# EAGLE design ardustation (EAGLE 5.11)
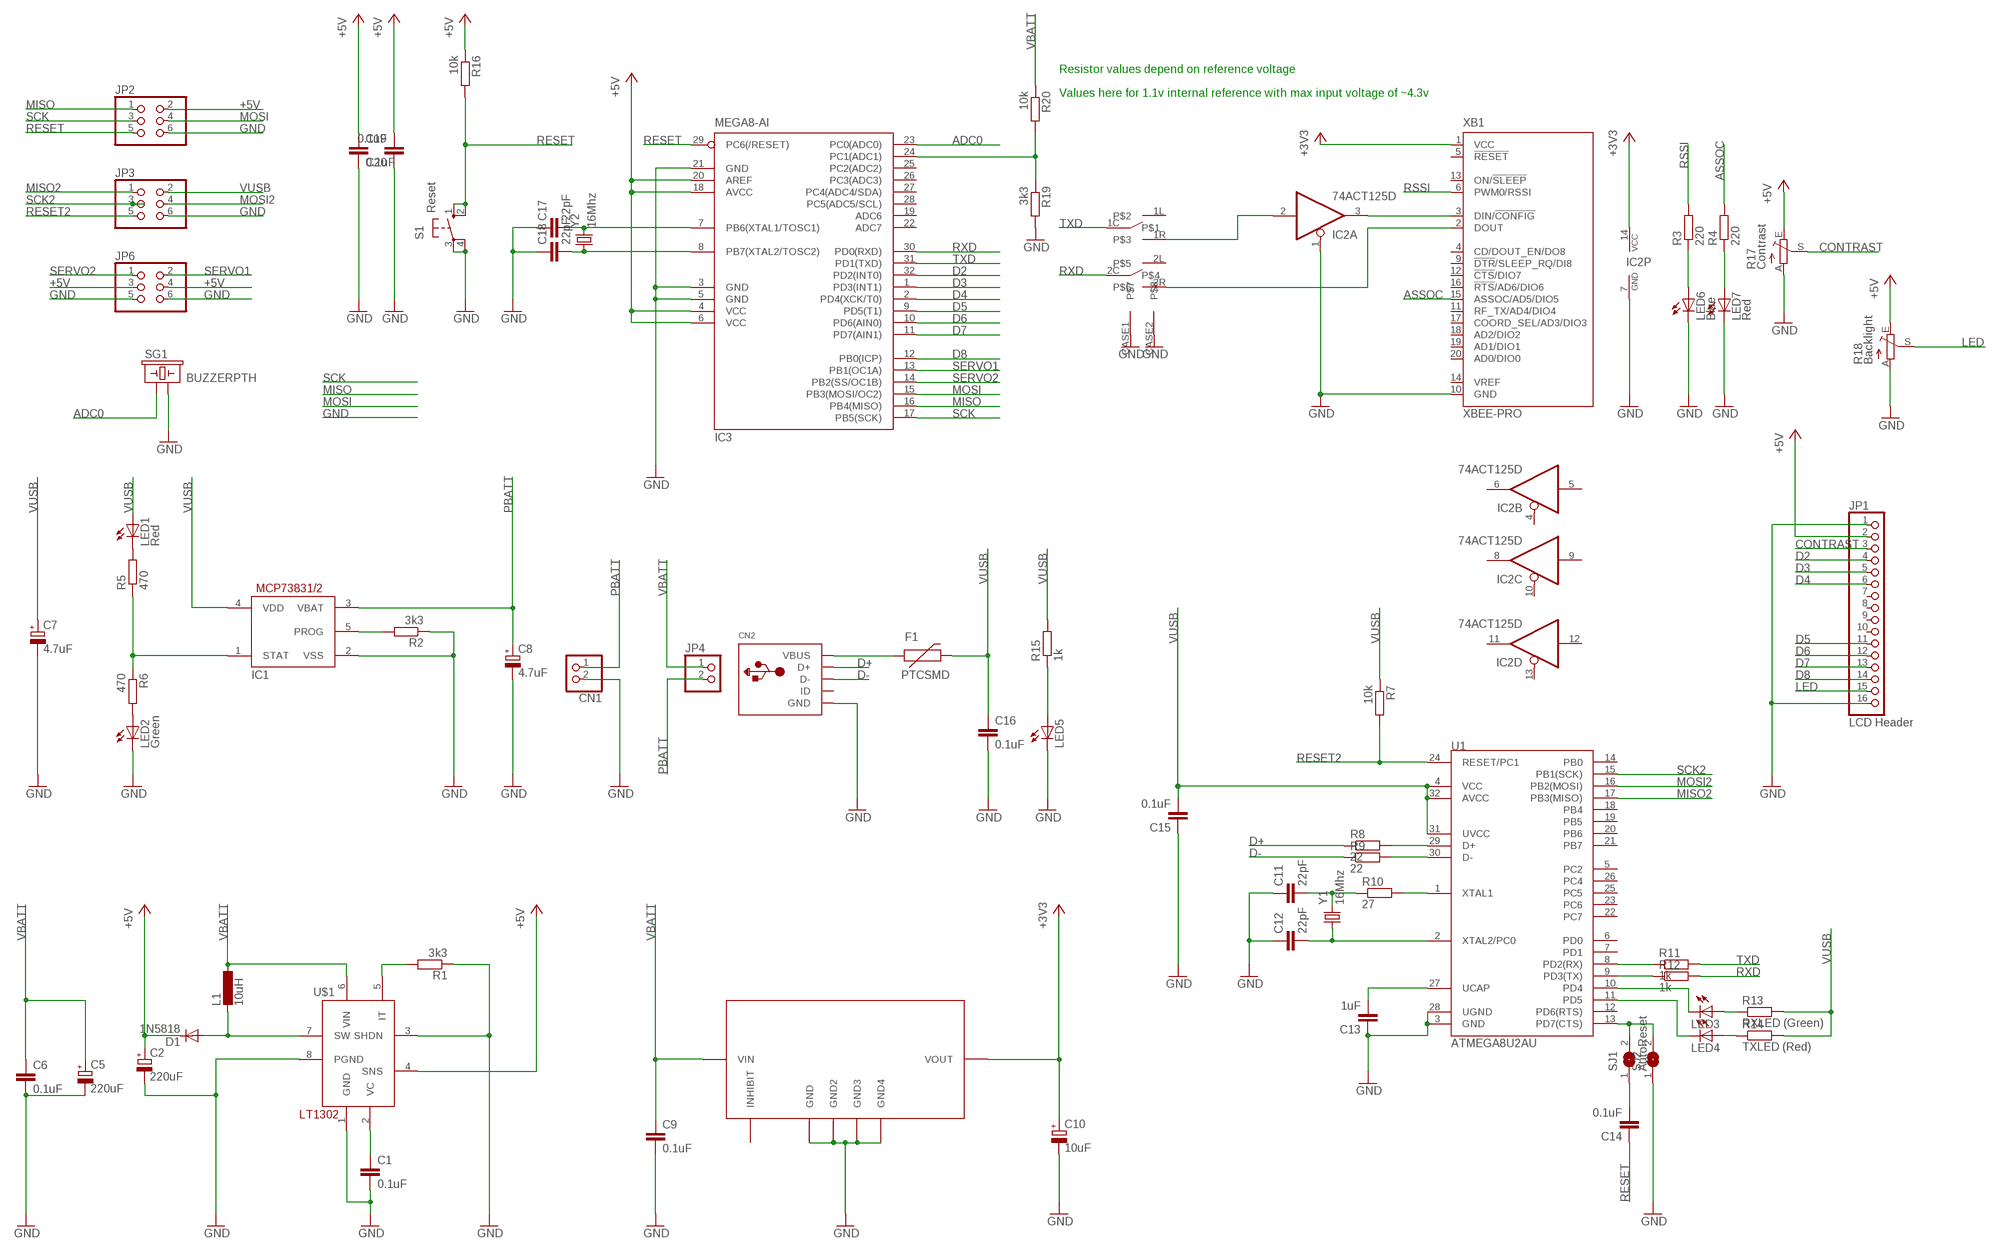
[diagram p0: schematic, sheet 1]

## Parts
C1  0.1uF  C-EUC0805  [C0805]
C2  220uF  CPOL-EUE2.5-7  [E2,5-7]
C5  220uF  CPOL-EUE2.5-7  [E2,5-7]
C6  0.1uF  C-EUC0805  [C0805]
C7  4.7uF  CPOL-EUA/3216-18R  [A/3216-18R]
C8  4.7uF  CPOL-EUA/3216-18R  [A/3216-18R]
C9  0.1uF  C-EUC0805  [C0805]
C10  10uF  CPOL-EUA/3216-18R  [A/3216-18R]
C11  22pF  C-EUC0805  [C0805]
C12  22pF  C-EUC0805  [C0805]
C13  1uF  C-EUC0805  [C0805]
C14  0.1uF  C-EUC0805  [C0805]
C15  0.1uF  C-EUC0805  [C0805]
C16  0.1uF  C-EUC0805  [C0805]
C17  22pF  C-EUC0805  [C0805]
C18  22pF  C-EUC0805  [C0805]
C19  0.1uF  C-EUC0805  [C0805]
C20  0.1uF  C-EUC0805  [C0805]
CN1  JST_2PIN-SMT-RA  [JST-PH-2-SMT-RA]
CN2  USB  [USB-MINIB-SMD-MOLEX]
D1  1N5818  DIODE-DO41-7.6  [DO41-7.6]
F1  PTCSMD  [PTC-1206]
IC1  MCP73831/OT  [SOT23-5L]
IC2  74ACT125D  [SO14]
IC3  MEGA8-AI  [TQFP32-08]
JP1  LCD Header  PINHD-1X16  [1X16]
JP2  PINHD-2X3/90  [2X03/90]
JP3  PINHD-2X3  [2X03]
JP4  PINHD-1X2/90  [1X02/90]
JP6  PINHD-2X3/90  [2X03/90]
L1  10uH  L-EU6000-XXX-RC  [6000-XXXX-RC]
LED1  Red  LEDCHIPLED_1206  [CHIPLED_1206]
LED2  Green  LEDCHIPLED_1206  [CHIPLED_1206]
LED3  LEDCHIPLED_1206  [CHIPLED_1206]
LED4  LEDCHIPLED_1206  [CHIPLED_1206]
LED5  LEDCHIPLED_1206  [CHIPLED_1206]
LED6  Blue  LEDCHIPLED_1206  [CHIPLED_1206]
LED7  Red  LEDCHIPLED_1206  [CHIPLED_1206]
R1  3k3  R-EU_R0805  [R0805]
R2  3k3  R-EU_R0805  [R0805]
R3  220  R-EU_R0805  [R0805]
R4  220  R-EU_R0805  [R0805]
R5  470  R-EU_R0805  [R0805]
R6  470  R-EU_R0805  [R0805]
R7  10k  R-EU_R0805  [R0805]
R8  22  R-EU_R0805  [R0805]
R9  22  R-EU_R0805  [R0805]
R10  27  R-EU_R0805  [R0805]
R11  1k  R-EU_R0805  [R0805]
R12  1k  R-EU_R0805  [R0805]
R13  RXLED (Green)  R-EU_R0805  [R0805]
R14  TXLED (Red)  R-EU_R0805  [R0805]
R15  1k  R-EU_R0805  [R0805]
R16  10k  R-EU_R0805  [R0805]
R17  Contrast  TRIM_EU-B25P  [B25P]
R18  Backlight  TRIM_EU-B25P  [B25P]
R19  3k3  R-EU_R0805  [R0805]
R20  10k  R-EU_R0805  [R0805]
S1  Reset  10-XX  [B3F-10XX]
SG1  BUZZERPTH  [BUZZER-12MM]
SJ1  AutoReset  SJ  [SJ]
SJ2  SJ  [SJ]
U1  ATMEGA8U2AU  [TQFP32-08]
U$1  LT1302  [DIL08]
U$2  KF33BD-TR  [SO-8]
U$3  MFP213N-RA  [MFP213N-RA]
XB1  XBEE-PRO  [XBEE-PRO]
Y1  16Mhz  CRYSTAL5X3  [CRYSTAL-SMD-5X3]
Y2  16Mhz  CRYSTAL5X3  [CRYSTAL-SMD-5X3]

## Nets
+3V3: C10.+ IC2.14(P:VCC) U$2.1(VOUT) XB1.1(VCC)
+5V: C2.+ C19.1 C20.2 D1.C IC3.4(VCC) IC3.6(VCC) IC3.18(AVCC) IC3.20(AREF) JP1.2 JP2.2 JP6.3 JP6.4 R16.1 R17.E R18.E U$1.4(SNS)
ADC0: IC3.23(PC0(ADC0)) SG1.+
ASSOC: R4.2 XB1.15(ASSOC/AD5/DIO5)
CONTRAST: JP1.3 R17.S
D2: IC3.32(PD2(INT0)) JP1.4
D3: IC3.1(PD3(INT1)) JP1.5
D4: IC3.2(PD4(XCK/T0)) JP1.6
D5: IC3.9(PD5(T1)) JP1.11
D6: IC3.10(PD6(AIN0)) JP1.12
D7: IC3.11(PD7(AIN1)) JP1.13
D8: IC3.12(PB0(ICP)) JP1.14
D+: CN2.D+ R8.1
D-: CN2.D- R9.1
GND: C1.2 C2.- C5.- C6.2 C7.- C8.- C9.2 C10.- C11.1 C12.1 C13.1 C15.1 C16.2 C17.1 C18.1 C19.2 C20.1 CN1.2 CN2.GND IC1.2(VSS) IC2.1(A:OE) IC2.7(P:GND) IC3.3(GND) IC3.5(GND) IC3.21(GND) JP1.1 JP1.16 JP2.6 JP3.6 JP6.5 JP6.6 LED2.C LED5.C LED6.C LED7.C R1.1 R2.1 R17.A R18.A R19.2 S1.3(P) S1.4(P1) SG1.- SJ2.1 U1.3(GND) U1.28(UGND) U$1.1(GND) U$1.3(SHDN) U$1.8(PGND) U$2.2(GND) U$2.3(GND2) U$2.6(GND3) U$2.7(GND4) U$3.CASE1 U$3.CASE2 XB1.10(GND)
LED: JP1.15 R18.S
MISO: IC3.16(PB4(MISO)) JP2.1
MISO2: JP3.1 U1.17(PB3(MISO))
MOSI: IC3.15(PB3(MOSI/OC2)) JP2.4
MOSI2: JP3.4 U1.16(PB2(MOSI))
N$1: R1.2 U$1.5(IT)
N$2: C1.1 U$1.2(VC)
N$3: IC1.5(PROG) R2.2
N$4: D1.A L1.2 U$1.7(SW)
N$5: LED5.A R15.1
N$6: IC2.2(A:I) U$3.1R
N$7: U$3.2R XB1.2(DOUT)
N$8: LED2.A R6.2
N$9: LED1.C R5.2
N$10: IC1.1(STAT) R5.1 R6.1
N$11: R11.1 U1.8(PD2(RX))
N$12: R10.2 U1.1(XTAL1)
N$13: R8.2 U1.29(D+)
N$14: R9.2 U1.30(D-)
N$15: C12.2 U1.2(XTAL2/PC0) Y1.1
N$16: LED6.A R3.1
N$17: C13.2 U1.27(UCAP)
N$18: R12.1 U1.9(PD3(TX))
N$19: LED7.A R4.1
N$20: IC3.24(PC1(ADC1)) R19.1 R20.2
N$21: LED3.C U1.10(PD4)
N$22: LED4.C U1.11(PD5)
N$23: LED3.A R13.1
N$24: LED4.A R14.1
N$25: SJ1.2 SJ2.2 U1.13(PD7(CTS))
N$26: C14.2 SJ1.1
N$27: CN2.VBUS F1.1
N$28: IC2.3(A:O) XB1.3(DIN/!CONFIG)
N$29: C11.2 R10.1 Y1.3
N$32: C18.2 IC3.8(PB7(XTAL2/TOSC2)) Y2.1
N$34: C17.2 IC3.7(PB6(XTAL1/TOSC1)) Y2.3
PBATT: C8.+ CN1.1 IC1.3(VBAT) JP4.2
RESET: C14.1 IC3.29(PC6(/RESET)) JP2.5 R16.2 S1.1(S) S1.2(S1)
RESET2: JP3.5 R7.2 U1.24(RESET/PC1)
RSSI: R3.2 XB1.6(PWM0/RSSI)
RXD: IC3.30(PD0(RXD)) R12.2 U$3.2C
SCK: IC3.17(PB5(SCK)) JP2.3
SCK2: JP3.3 U1.15(PB1(SCK))
SERVO1: IC3.13(PB1(OC1A)) JP6.2
SERVO2: IC3.14(PB2(SS/OC1B)) JP6.1
TXD: IC3.31(PD1(TXD)) R11.2 U$3.1C
VBATT: C5.+ C6.1 C9.1 JP4.1 L1.1 R20.1 U$1.6(VIN) U$2.8(VIN)
VUSB: C7.+ C15.2 C16.1 F1.2 IC1.4(VDD) JP3.2 LED1.A R7.1 R13.2 R14.2 R15.2 U1.4(VCC) U1.31(UVCC) U1.32(AVCC)
Unconnected: CN2.ID IC2.4(B:OE) IC2.5(B:I) IC2.6(B:O) IC2.8(C:O) IC2.9(C:I) IC2.10(C:OE) IC2.11(D:O) IC2.12(D:I) IC2.13(D:OE) IC3.19(ADC6) IC3.22(ADC7) IC3.25(PC2(ADC2)) IC3.26(PC3(ADC3)) IC3.27(PC4(ADC4/SDA)) IC3.28(PC5(ADC5/SCL)) JP1.7 JP1.8 JP1.9 JP1.10 U1.5(PC2) U1.6(PD0) U1.7(PD1) U1.12(PD6(RTS)) U1.14(PB0) U1.18(PB4) U1.19(PB5) U1.20(PB6) U1.21(PB7) U1.22(PC7) U1.23(PC6) U1.25(PC5) U1.26(PC4) U$2.5(INHIBIT) U$3.1L U$3.2L XB1.4(CD/DOUT_EN/DO8) XB1.5(!RESET) XB1.9(!DTR!/SLEEP_RQ/DI8) XB1.11(RF_TX/AD4/DIO4) XB1.12(!CTS!/DIO7) XB1.13(ON/!SLEEP) XB1.14(VREF) XB1.16(!RTS!/AD6/DIO6) XB1.17(COORD_SEL/AD3/DIO3) XB1.18(AD2/DIO2) XB1.19(AD1/DIO1) XB1.20(AD0/DIO0)

## Notes on the sheet
- Resistor values depend on reference voltage
- Values here for 1.1v internal reference with max input voltage of ~4.3v

## Library data of the parts
C1 C6 C9 C11-C20 = rcl:C-EU: CAPACITOR, European symbol
C2 C5 C7 C8 C10 = rcl:CPOL-EU: POLARIZED CAPACITOR, European symbol
CN1 = adafruit:JST_2PIN: JST 2-Pin Connectors of various flavors SMT-RA (S2B-PH-SM4) 4UConnector #17311 SMT (B2B-PH-SM4) THM-RA (S2B-PH) THM (B2B-PH)
CN2 = colin:USB: USB Connectors USBMINIB - Surface Mount Female Mini-B USB Connector 4UConnector: 06564 By microbuilder.eu Thru-hole RA Female Mini-B USB Connector 4UConnector: 18732 By ladyada.net
D1 = diode:DIODE-: DIODE
F1 = SparkFun:PTC: Resettable Fuse PTC Resettable Fuse. Spark Fun Electronics SKU : COM-08357
IC1 = adafruit:MCP73831: MCP73831/2 Miniature Single-Cell, Fully Integrated Li-Ion, Li-Polymer Charge Management Controllers. Nice and small simple lipoly charge controller, with adjustable current and status output (LED) http://www.ladyada.net/library/pcb/eaglelibrary.html
IC2 = 74xx-eu:74*125: Quad bus BUFFER, 3-state
IC3 = atmel:MEGA8: MICROCONTROLLER 8 Kbytes FLASH, 1 kbytes SRAM, 512 bytes EEPROM, USART, 6-channel 10 bit ADC, 2-channel 8 bit ADC Pin compatible with Atmega48, ATMega88, ATMega168 Source: avr.lbr; MPN: ATMEGA8-16AU; OC_FARNELL: 9171371; OC_NEWARK: 73M8863
JP1 = pinhead:PINHD-1X16: PIN HEADER
JP2 JP3 JP6 = pinhead:PINHD-2X3: PIN HEADER
JP4 = pinhead:PINHD-1X2: PIN HEADER
L1 = rcl:L-EU: INDUCTOR, European symbol
LED1-LED7 = led:LED: LED OSRAM: - CHIPLED LG R971, LG N971, LY N971, LG Q971, LY Q971, LO R971, LY R971 LH N974, LH R974 LS Q976, LO Q976, LY Q976 LO Q996 - Hyper CHIPLED LW Q18S LB Q993, LB Q99A, LB R99A - SideLED LS A670, LO A670, LY A670, LG A670, LP A670 LB A673, LV A673, LT A673, LW A673 LH A674 LY A675 LS A676, LA A676, LO A676, LY A676, LW A676 LS A679, LY A679, LG A679 - Hyper Micro SIDELED® LS Y876, LA Y876, LO Y876, LY Y876 LT Y87S - SmartLED LW L88C, LW L88S LB L89C, LB L89S, LG L890 LS L89K, LO L89K, LY L89K LS L896, LA L896, LO L896, LY L896 - TOPLED LS T670, LO T670, LY T670, LG T670, LP T670 LSG T670, LSP T670, LSY T670, LOP T670, LYG T670 LG T671, LOG T671, LSG T671 LB T673, LV T673, LT T673, LW T673 LH T674 LS T676, LA T676, LO T676, LY T676, LB T676, LH T676, LSB T676, LW T676 LB T67C, LV T67C, LT T67C, LS T67K, LO T67K, LY T67K, LW E67C LS E67B, LA E67B, LO E67B, LY E67B, LB E67C, LV E67C, LT E67C LW T67C LS T679, LY T679, LG T679 LS T770, LO T770, LY T770, LG T770, LP T770 LB T773, LV T773, LT T773, LW T773 LH T774 LS E675, LA E675, LY E675, LS T675 LS T776, LA T776, LO T776, LY T776, LB T776 LHGB T686 LT T68C, LB T68C - Hyper Mini TOPLED® LB M676 - Mini TOPLED Santana® LG M470 LS M47K, LO M47K, LY M47K Source: http://www.osram.convergy.de LUXEON: - LUMILED® LXK2-PW12-R00, LXK2-PW12-S00, LXK2-PW14-U00, LXK2-PW14-V00 LXK2-PM12-R00, LXK2-PM12-S00, LXK2-PM14-U00 LXK2-PE12-Q00, LXK2-PE12-R00, LXK2-PE12-S00, LXK2-PE14-T00, LXK2-PE14-U00 LXK2-PB12-K00, LXK2-PB12-L00, LXK2-PB12-M00, LXK2-PB14-N00, LXK2-PB14-P00, LXK2-PB14-Q00 LXK2-PR12-L00, LXK2-PR12-M00, LXK2-PR14-Q00, LXK2-PR14-R00 LXK2-PD12-Q00, LXK2-PD12-R00, LXK2-PD12-S00 LXK2-PH12-R00, LXK2-PH12-S00 LXK2-PL12-P00, LXK2-PL12-Q00, LXK2-PL12-R00 Source: www.luxeon.com KINGBRIGHT: KA-3528ASYC Source: www.kingbright.com
R1-R16 R19 R20 = rcl:R-EU_: RESISTOR, European symbol
R17 R18 = pot:TRIM_EU-: POTENTIOMETER
S1 = switch-omron:10-XX: OMRON SWITCH; MPN: B3F-1000; OC_FARNELL: 176432; OC_NEWARK: 36M3542
SG1 = SparkFun:BUZZER: Buzzer 12mm Spark Fun Electronics SKU : Comp-Buzzer
SJ1 SJ2 = jumper:SJ: SMD solder JUMPER
U1 = SparkFun:ATMEGA8U2: Atmel 8-bit Microcontroller with 8/16/32K Bystes of ISP Flash and USB Controller. ATmega8U2, ATmega16U2, and ATmega32U2
U$1 = adafruit:LT1302
U$2 = colin:KF33BD-TR
U$3 = colin:MFP213N-RA
XB1 = maxstream:XBEE: XBee (TM) /XBee-PRO(TM) OEM RF Modules Source: MaxStream, Inc. xbee_productmanual.pdf; MPN: XBP24-AWI-001; OC_FARNELL: 1337916; OC_NEWARK: 42M2667
Y1 Y2 = SparkFun:CRYSTAL: Crystals Various standard crystals. Proven footprints. Spark Fun Electronics SKU : COM-00534

## Board
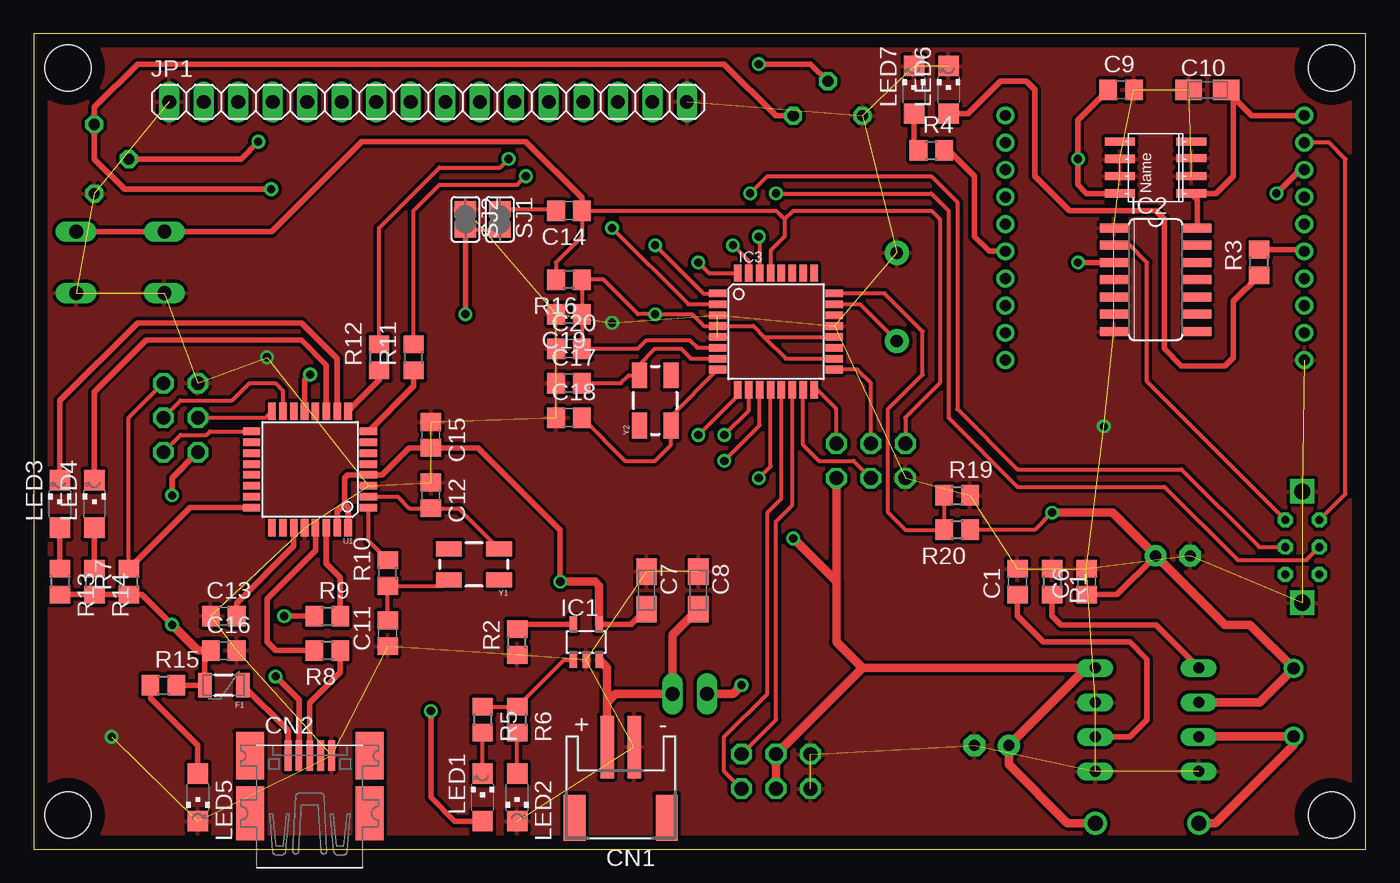
[diagram p1: board, top side]
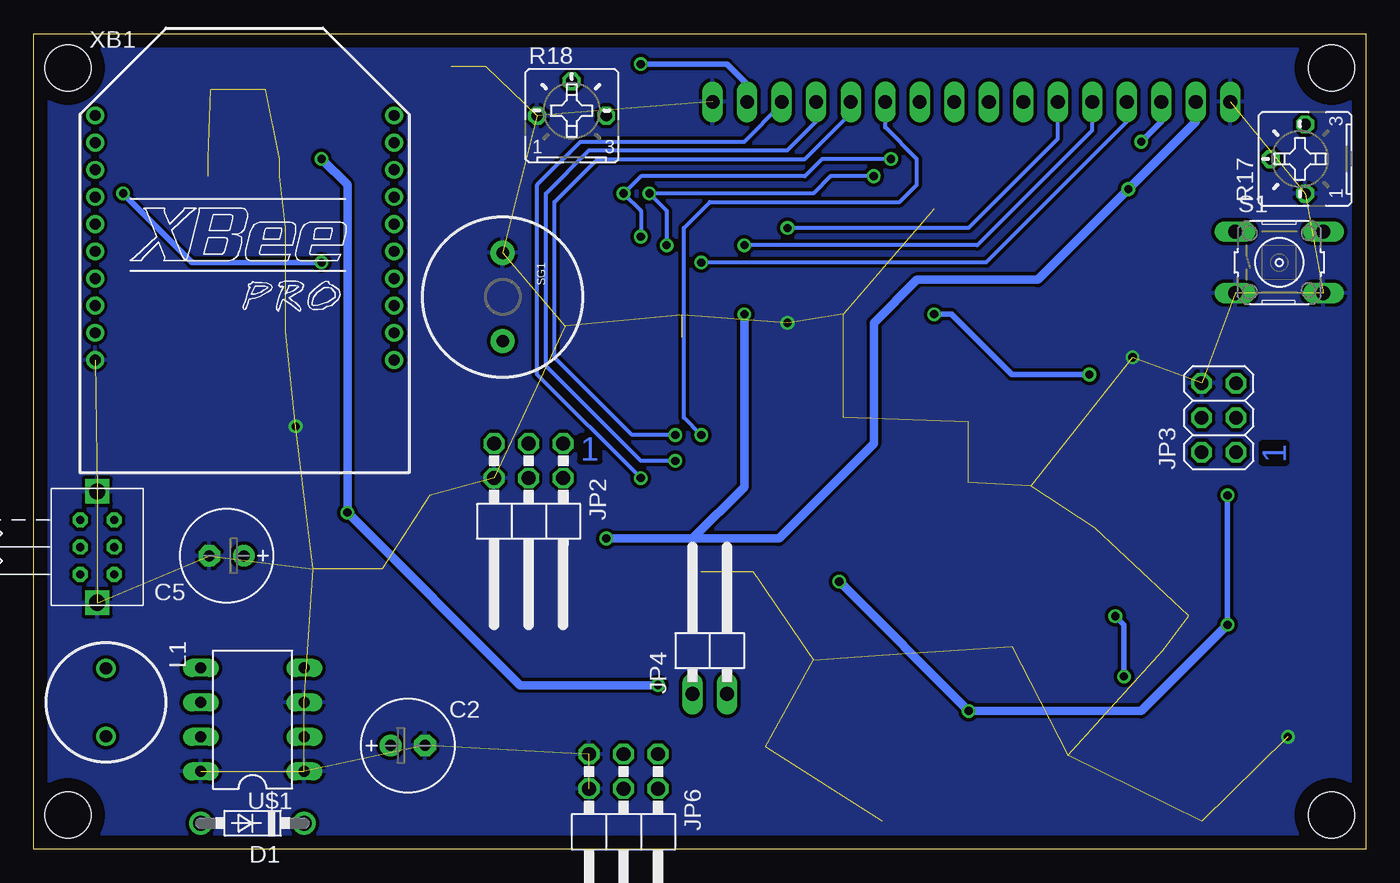
[diagram p2: board, bottom side, seen from below]

Size 98 x 60 mm. Coordinates in mm from the lower left corner, seen from the top.
Outline: 0,0 98,0 98,60 0,60 0,0
Copper layers (1*16): Top 0.035mm / dielectric 1.5mm / Bottom 0.035mm
Design rules "default *": minimum track width 10mil, minimum drill 0.6mm, track to track 8mil, track to pad 8mil, pad to pad 8mil, via to via 8mil, smd to smd 8mil, copper to edge 40mil, drill to drill 8mil, minimum pad ring 10mil, minimum via ring 8mil, stop-mask expansion 4mil, vias tented up to drill 0mil, thermal gap 10mil
Holes 3.4 mm at 2.5,57.5 2.5,2.5 95.5,2.5 95.5,57.5

### Footprints (pad centres in the part's own frame; a part is rotated, then mirrored left to right if it is on the bottom)
C0805 = smd 1.3 x 1.5: 1 -0.95,0; 2 0.95,0
E2,5-7 = drill 0.813 pad 1.6 round: + -1.27,0 | drill 0.813 pad 1.6 octagon: - 1.27,0
A/3216-18R = smd 1.95 x 1.5: + 1.375,0; - -1.375,0
JST-PH-2-SMT-RA = smd 1 x 4.6: 1 1,-3.7; 2 -1,-3.7 | smd 1.6 x 3.4: NC1 -3.4,1.5; NC2 3.4,1.5
USB-MINIB-SMD-MOLEX = smd 0.5 x 2.25: D+ 0,3.75; D- -0.8,3.75; GND 1.6,3.75; ID 0.8,3.75; VBUS -1.6,3.75 | smd 2.05 x 4: GND1 -4.4,-0.5; GND4 4.4,-0.5 | smd 2.05 x 3.5: GND2 -4.4,3.75; GND3 4.4,3.75
DO41-7.6 = drill 1.1 pad 1.7 round: A 3.81,0; C -3.81,0
PTC-1206 = smd 1 x 1.8: 1 -1.4,0; 2 1.4,0
SOT23-5L = smd 0.55 x 1.2: 1 -0.95,-1.3; 2 0,-1.3; 3 0.95,-1.3; 4 0.95,1.3; 5 -0.95,1.3
SO14 = smd 0.66 x 2.032: 1 -3.81,-3.073; 2 -2.54,-3.073; 3 -1.27,-3.073; 4 0,-3.073; 5 1.27,-3.073; 6 2.54,-3.073; 7 3.81,-3.073; 8 3.81,3.073; 9 2.54,3.073; 10 1.27,3.073; 11 0,3.073; 12 -1.27,3.073; 13 -2.54,3.073; 14 -3.81,3.073
TQFP32-08 = smd 1.27 x 0.559: 1 -4.293,2.8; 2 -4.293,2; 3 -4.293,1.2; 4 -4.293,0.4; 5 -4.293,-0.4; 6 -4.293,-1.2; 7 -4.293,-2; 8 -4.293,-2.8; 17 4.293,-2.8; 18 4.293,-2; 19 4.293,-1.2; 20 4.293,-0.4; 21 4.293,0.4; 22 4.293,1.2; 23 4.293,2; 24 4.293,2.8 | smd 0.559 x 1.27: 9 -2.8,-4.293; 10 -2,-4.293; 11 -1.2,-4.293; 12 -0.4,-4.293; 13 0.4,-4.293; 14 1.2,-4.293; 15 2,-4.293; 16 2.8,-4.293; 25 2.8,4.293; 26 2,4.293; 27 1.2,4.293; 28 0.4,4.293; 29 -0.4,4.293; 30 -1.2,4.293; 31 -2,4.293; 32 -2.8,4.293
1X16 = drill 1.016 long: 1 -19.05,0; 2 -16.51,0; 3 -13.97,0; 4 -11.43,0; 5 -8.89,0; 6 -6.35,0; 7 -3.81,0; 8 -1.27,0; 9 1.27,0; 10 3.81,0; 11 6.35,0; 12 8.89,0; 13 11.43,0; 14 13.97,0; 15 16.51,0; 16 19.05,0
2X03/90 = drill 1.016 octagon: 1 -2.54,-6.35; 2 -2.54,-3.81; 3 0,-6.35; 4 0,-3.81; 5 2.54,-6.35; 6 2.54,-3.81
2X03 = drill 1.016 octagon: 1 -2.54,-1.27; 2 -2.54,1.27; 3 0,-1.27; 4 0,1.27; 5 2.54,-1.27; 6 2.54,1.27
1X02/90 = drill 1.016 long: 1 -1.27,-3.81; 2 1.27,-3.81
6000-XXXX-RC = drill 0.9 pad 1.422 round: 1 -2.5,0; 2 2.5,0
CHIPLED_1206 = smd 1.5 x 1.5: A 0,-1.75; C 0,1.75
R0805 = smd 1.3 x 1.5: 1 -0.95,0; 2 0.95,0
B25P = drill 0.813 octagon: A -2.54,0; E 2.54,0; S 0,2.54
B3F-10XX = drill 1.016 long: 1 -3.251,2.261; 2 3.251,2.261; 3 -3.251,-2.261; 4 3.251,-2.261
BUZZER-12MM = drill 0.9 pad 1.778 round: + 3.25,0; - -3.25,0
SJ = smd 1.168 x 1.6: 1 -0.762,0; 2 0.762,0
DIL08 = drill 0.813 long: 1 -3.81,-3.81; 2 -1.27,-3.81; 3 1.27,-3.81; 4 3.81,-3.81; 5 3.81,3.81; 6 1.27,3.81; 7 -1.27,3.81; 8 -3.81,3.81
SO-8 = smd 0.61 x 2.21: 1 -1.905,-2.616; 2 -0.635,-2.616; 3 0.686,-2.616; 4 1.905,-2.616; 5 1.905,2.616; 6 0.635,2.616; 7 -0.635,2.616; 8 -1.905,2.616
MFP213N-RA = drill 0.6 octagon: 1C 0,-1.25; 1L -2,-1.25; 1R 2,-1.25; 2C 0,1.25; 2L -2,1.25; 2R 2,1.25 | drill 1.2 square: CASE1 -4.1,0; CASE2 4.1,0
XBEE-PRO = drill 0.8 pad 1.27 round: 1 -11,9; 2 -11,7; 3 -11,5; 4 -11,3; 5 -11,1; 6 -11,-1; 7 -11,-3; 8 -11,-5; 9 -11,-7; 10 -11,-9; 11 11,-9; 12 11,-7; 13 11,-5; 14 11,-3; 15 11,-1; 16 11,1; 17 11,3; 18 11,5; 19 11,7; 20 11,9
CRYSTAL-SMD-5X3 = smd 1.9 x 1.1: 1 -1.85,-1.15; 2 1.85,-1.15; 3 1.85,1.15; 4 -1.85,1.15

### Placement (x,y rotation side)
C1  72.39,19.68 90 top
C2  70.48,7.62 0 bottom
C5  83.82,21.59 180 bottom
C6  77.47,19.68 90 top
C7  45.09,19.05 270 top
C8  48.9,19.05 270 top
C9  80.01,55.88 0 top
C10  86.36,55.88 0 top
C11  26.04,15.88 90 top
C12  29.21,26.04 270 top
C13  13.97,17.14 0 top
C14  39.37,46.99 180 top
C15  29.21,30.48 270 top
C16  13.97,14.61 0 top
C17  39.37,34.29 0 top
C18  39.37,31.75 0 top
C19  39.37,39.37 180 top
C20  39.37,36.83 0 top
CN1  43.18,3.81 180 top
CN2  20.3,3.13 0 top
D1  81.92,1.91 180 bottom
F1  13.97,12.06 180 top
IC1  40.64,15.24 0 top
IC2  82.55,41.91 270 top
IC3  54.61,38.1 0 top
JP1  29,55 0 top
JP2  61.59,23.5 180 bottom
JP3  10.79,31.75 90 bottom
JP4  48.26,15.24 0 bottom
JP6  54.61,0.64 180 bottom
L1  92.71,10.79 270 bottom
LED1  33.02,3.81 0 top
LED2  35.56,3.81 180 top
LED3  1.91,25.4 0 top
LED4  4.45,25.4 0 top
LED5  12.06,3.81 180 top
LED6  67.31,55.88 0 top
LED7  64.77,55.88 0 top
R1  74.93,19.68 270 top
R2  35.56,15.24 90 top
R3  90.17,43.18 90 top
R4  66.04,51.44 0 top
R5  33.02,9.53 270 top
R6  35.56,9.53 270 top
R7  6.99,19.68 90 top
R8  21.59,14.61 180 top
R9  21.59,17.14 0 top
R10  26.04,20.32 90 top
R11  27.94,36.2 90 top
R12  25.4,36.2 90 top
R13  1.91,19.68 270 top
R14  4.45,19.68 270 top
R15  9.53,12.06 0 top
R16  39.37,41.91 180 top
R17  4.45,50.8 90 bottom
R18  58.42,53.98 0 bottom
R19  67.94,26.04 0 top
R20  67.94,23.5 180 top
S1  6.35,43.18 0 bottom
SG1  63.5,40.64 270 bottom
SJ1  34.29,46.35 270 top
SJ2  31.75,46.35 270 top
U1  20.32,27.94 180 top
U$1  81.92,9.53 90 bottom
U$2  82.55,50.16 90 top
U$3  93.34,22.23 90 bottom
XB1  82.5,45 0 bottom
Y1  32.38,20.95 180 top
Y2  45.72,33.02 90 top

### Tracks (layer width: path | path; a pad name or v marks a point on that pad's centre or on a via)
+3V3
  Top 0.406: IC2.14 85.62,47.8 U$2.1 87,48.26 88.27,49.53 88.27,55.38 87.76,55.88 C10.+ 89.61,54 XB1.1
+5V  (via drill 0.6)
  Top 0.305: IC3.6 48.83,36.9 48.26,37.47 45.09,37.47 44.45,36.83 C20.2 C19.1 R16.1 41.91,41.91 44.45,39.37 v45.72,39.37 | 53.74,37.7 IC3.20 | 53.74,37.7 52.94,38.5 IC3.4 49.3,38.5 48.42,39.37 v45.72,39.37 | IC3.18 55.34,36.1 53.74,37.7 | v45.72,39.37 46.35,39.37
  Top 0.406: v17.46,48.58 6.67,48.58 4.45,50.8 R17.E 4.45,54.61 7.62,57.78 50.8,57.78 54.61,53.98 R18.E
  Top 0.61: JP6.4 JP6.3 60.96,13.34 | D1.C 76.07,1.91 71.75,6.22 C2.+ 77.47,13.34 U$1.4 60.96,13.34 | 59.05,19.68 59.05,15.24 60.96,13.34 | 59.05,19.68 JP2.2 | v55.88,22.86 59.05,19.68
  Bottom 0.61: JP1.2 12.49,53.55 v17.46,48.58 24.13,41.91 33.02,41.91 36.2,38.73 36.2,29.84 43.18,22.86 49.53,22.86 | 49.53,22.86 v55.88,22.86 | v45.72,39.37 45.72,26.67 49.53,22.86
ADC0
  Top 0.305: SG1.+ 60.79,40.1 IC3.23
ASSOC
  Top 0.406: XB1.15 70.3,44 69.22,45.09 69.22,49.53 67.31,51.44 R4.2
CONTRAST  (via drill 0.6)
  Top 0.406: R17.S 15.24,50.8 v16.51,52.07
  Bottom 0.406: v16.51,52.07 15.03,53.55 JP1.3
D2  (via drill 0.6)
  Top 0.305: IC3.32 49.68,42.39 v48.9,43.18
  Bottom 0.305: v48.9,43.18 27.94,43.18 17.57,53.55 JP1.4
D3  (via drill 0.6)
  Top 0.305: v45.72,44.45 49.27,40.9 IC3.1
  Bottom 0.305: JP1.5 20.11,52.91 28.57,44.45 v45.72,44.45
D4  (via drill 0.6)
  Top 0.305: v42.55,45.72 48.16,40.1 IC3.2
  Bottom 0.305: JP1.6 22.65,52.28 29.21,45.72 v42.55,45.72
D5  (via drill 0.6)
  Top 0.305: IC3.9 51.81,33.4 v48.9,30.48
  Bottom 0.305: JP1.11 35.35,53.13 33.02,50.8 33.02,48.9 34.29,47.62 48.26,47.62 50.16,45.72 50.16,31.75 v48.9,30.48
D6  (via drill 0.6)
  Top 0.305: IC3.10 52.61,32.29 v50.8,30.48
  Bottom 0.305: JP1.12 37.89,54.19 41.27,50.8 56.52,50.8 59.69,47.62 59.69,36.2 53.98,30.48 v50.8,30.48
D7  (via drill 0.6)
  Top 0.305: IC3.11 53.41,31.18 v50.8,28.57
  Bottom 0.305: JP1.13 40.43,53.55 42.55,51.44 57.15,51.44 60.33,48.26 60.33,35.56 53.34,28.57 v50.8,28.57
D8  (via drill 0.6)
  Top 0.305: IC3.12 54.21,28.18 v53.34,27.3
  Bottom 0.305: JP1.14 42.97,54.82 45.72,52.07 57.78,52.07 60.96,48.9 60.96,34.92 v53.34,27.3
D+
  Top 0.406: R8.1 22.54,13.02 20.3,10.78 CN2.D+
D-  (via drill 0.6)
  Top 0.406: v18.41,17.14 R9.1 | CN2.D- 19.5,10.98 v17.78,12.7
  Bottom 0.406: v18.41,17.14 17.78,16.51 v17.78,12.7
GND  (via drill 0.6)  (59 unrouted)
  other vias: 42.55,38.73 5.71,8.26 78.74,31.11 17.14,36.2
  pour Top (isolate 0.254): 0,0 98,0 98,60 0,60
  pour Bottom (isolate 0.254): 0,0 98,0 98,60 0,60
LED  (via drill 0.6)
  Top 0.406: R18.S 57.15,57.78 v53.34,57.78
  Bottom 0.406: v53.34,57.78 46.99,57.78 45.51,56.3 JP1.15
MISO
  Top 0.305: JP2.1 59.05,32.38 57.63,33.81 IC3.16
MISO2
  Top 0.305: JP3.1 10.79,30.48 12.7,30.48 12.96,30.74 U1.17
MOSI
  Top 0.305: JP2.4 60.33,28.57 57.78,28.57 56.61,29.75 IC3.15
MOSI2
  Top 0.305: U1.16 17.04,31.75 JP3.4
N$1
  Top 0.406: R1.2 74.93,17.14 75.56,16.51 80.64,16.51 81.92,16.51 82.55,16.51 U$1.5
N$2
  Top 0.406: U$1.2 80.64,8.26 81.92,9.53 81.92,13.97 80.64,15.24 74.3,15.24 72.39,17.14 C1.1
N$3
  Top 0.406: IC1.5 35.91,16.54 R2.2
N$4
  Top 0.61: D1.A 86.95,1.91 92.71,7.66 L1.2 85.77,8.29 U$1.7
N$5
  Top 0.406: LED5.A 12.06,7.62 8.57,11.11 R15.1
N$6
  Top 0.305: U$3.1R 81.92,34.41 81.92,43.18 80.64,44.45 IC2.2
N$7
  Top 0.305: U$3.2R 96.52,26.15 96.52,50.8 95.32,52 XB1.2
N$8
  Top 0.305: LED2.A R6.2
N$9
  Top 0.305: LED1.C R5.2
N$10
  Top 0.305: IC1.1 39.02,13.94 R6.1 R5.1
N$11
  Top 0.406: U1.8 27.94,34.07 R11.1
N$12
  Top 0.305: R10.2 24.61,22.69 U1.1
N$13
  Top 0.406: R8.2 17.78,14.61 17.14,15.24 17.14,18.41 20.72,21.99 U1.29
N$14
  Top 0.406: U1.30 21.52,21.02 22.54,20 R9.2
N$15
  Top 0.305: U1.2 26.77,25.94 27.62,25.09 C12.2 31.25,25.09 Y1.1
N$16
  Top 0.406: R3.1 88.27,40.33 88.27,36.2 87.63,35.56 84.45,35.56 83.19,36.83 83.19,46.35 82.55,46.99 76.2,46.99 73.66,49.53 73.66,55.88 73.03,56.52 71.12,56.52 68.73,54.13 LED6.A
N$17
  Top 0.406: C13.2 14.92,18.09 19.12,22.3 U1.27
N$18
  Top 0.406: U1.9 25.4,34.51 R12.1
N$19
  Top 0.406: R4.1 64.77,51.76 LED7.A
N$20
  Top 0.305: IC3.24 62.6,40.9 65.41,38.1 65.41,34.92 62.87,32.38 62.87,24.77 64.14,23.5 R20.2 R19.1
N$21
  Top 0.406: LED3.C 1.91,33.02 7.62,38.73 19.68,38.73 22.32,36.1 U1.10
N$22
  Top 0.406: LED4.C 4.45,33.66 8.26,37.47 19.68,37.47 21.52,35.63 U1.11
N$23
  Top 0.406: R13.1 LED3.A
N$24
  Top 0.406: R14.1 LED4.A
N$25  (via drill 0.6)
  Top 0.305: SJ2.2 SJ1.2
  Top 0.406: U1.13 19.92,34.52 v20.32,34.92 | v31.75,39.37 SJ2.2
  Bottom 0.406: v20.32,34.92 26.04,34.92 30.48,39.37 v31.75,39.37
N$26
  Top 0.305: SJ1.1 38.29,47.12 C14.2
N$27
  Top 0.406: CN2.VBUS 18.7,8.73 F1.1
N$28  (via drill 0.6)
  Top 0.406: v76.83,43.18 IC2.3 | v91.44,48.26 93.18,50 XB1.3
  Bottom 0.406: v76.83,43.18 86.36,43.18 v91.44,48.26
N$29
  Top 0.305: C11.2 R10.1 30.1,19.37 Y1.3
N$32
  Top 0.305: IC3.8 46.87,31.85 Y2.1 46.87,29.73 45.72,28.57 43.49,28.57 C18.2
N$34
  Top 0.305: IC3.7 48.35,36.1 47.62,36.83 45.72,36.83 44.57,35.68 Y2.3 43.76,34.87 43.18,34.29 C17.2
PBATT
  Top 0.61: CN1.1 42.18,10.79 | 42.18,10.79 42.18,13.35 IC1.3 | 42.18,10.79 42.81,11.43 JP4.2 46.99,15.77 C8.+
RESET
  Top 0.305: IC3.29 54.21,44.05 55.24,45.09 55.24,46.35 | 55.24,46.35 54.61,46.99 C14.1 40.32,45.09 38.42,43.19 R16.2 | JP2.5 64.14,31.75 66.67,34.29 66.67,46.35 66.04,46.99 55.88,46.99 55.24,46.35
  Top 0.406: S1.2 S1.1 17.5,45.44 24.13,52.07 36.2,52.07 40.32,47.95 C14.1
RESET2
  Top 0.305: JP3.5 6.99,31.75 R7.2
  Top 0.406: U1.24 11.49,25.14 R7.2
RSSI
  Top 0.406: XB1.6 93.37,44.13 R3.2
RXD  (via drill 0.6)
  Top 0.305: v54.61,48.26 66.04,48.26 67.31,46.99 67.31,31.75 72.39,26.67 83.19,26.67 88.58,21.27 93.64,21.27 U$3.2C | R12.2 25.4,45.72 29.84,50.16 34.29,50.16 v34.92,50.8 | IC3.30 53.41,45.02 v53.34,45.09
  Bottom 0.305: v53.34,45.09 53.34,46.99 v54.61,48.26 53.34,49.53 41.27,49.53 40.01,50.8 v34.92,50.8
SCK
  Top 0.305: JP2.3 61.59,34.29 60.59,35.3 IC3.17
SCK2
  Top 0.305: JP3.3 10.79,33.02 14.61,33.02 15.88,34.29 17.78,34.29 18.32,33.75 U1.15
SERVO1
  Top 0.305: JP6.2 50.8,5.71 50.8,8.26 53.98,11.43 53.98,24.77 55.01,25.8 IC3.13
SERVO2
  Top 0.305: JP6.1 54.61,9.53 54.61,24.13 55.81,25.33 IC3.14
TXD  (via drill 0.6)
  Top 0.305: IC3.31 52.61,43.27 v51.44,44.45 | v52.7,48.26 53.98,49.53 66.04,49.53 67.94,47.62 67.94,32.38 72.39,27.94 84.45,27.94 90.17,22.23 U$3.1C | R11.2 27.94,46.99 29.84,48.9 35.56,48.9 v36.2,49.53
  Bottom 0.305: v51.44,44.45 51.44,46.99 v52.7,48.26 40.64,48.26 39.37,49.53 v36.2,49.53
VBATT  (via drill 0.6)
  Top 0.305: R20.1 73.66,23.5 v74.93,24.77
  Top 0.406: U$2.8 77.47,48.26 76.83,48.9 v76.83,50.8 76.83,53.66 C9.1 | C6.1 79.69,18.73 C5.+
  Top 0.61: U$1.6 90.21,10.79 L1.1 89.5,16.51 87.63,16.51 C5.+ 79.38,24.77 v74.93,24.77 | JP4.1 51.44,11.43 v52.07,12.06
  Bottom 0.61: v76.83,50.8 74.93,48.9 v74.93,24.77 62.23,12.06 v52.07,12.06
VUSB  (via drill 0.6)
  Top 0.406: IC1.4 43.98,16.54 43.98,16.57 C7.+ | R15.2 F1.2 12.57,13.84 13.02,14.29 C16.1 | R13.2 R14.2 R7.1 7.93,18.73 v10.16,16.51 | JP3.2 10.16,27.3 v10.16,26.04 | LED1.A 30.96,2.06 29.21,3.81 v29.21,10.16 | 22.86,25.4 22.86,27.3 23.09,27.54 U1.4 25.64,27.54 27.62,29.53 C15.2 32.7,29.53 38.73,23.5 v38.73,19.68 | U1.32 23.12,25.14 22.86,25.4 | U1.31 22.32,24.86 22.86,25.4
  Top 0.61: v38.73,19.68 41.27,19.68 41.59,19.37 IC1.4 | C16.1 12.06,14.61 v10.16,16.51
  Bottom 0.406: v10.16,16.51 v10.16,26.04
  Bottom 0.61: v10.16,16.51 16.51,10.16 v29.21,10.16 v38.73,19.68

### Text on the board
Bottom: 1 | 1